# EAGLE design clock_motherboard (EAGLE 7.4.0)
DATABASE: ../../PartsDatabase.txt
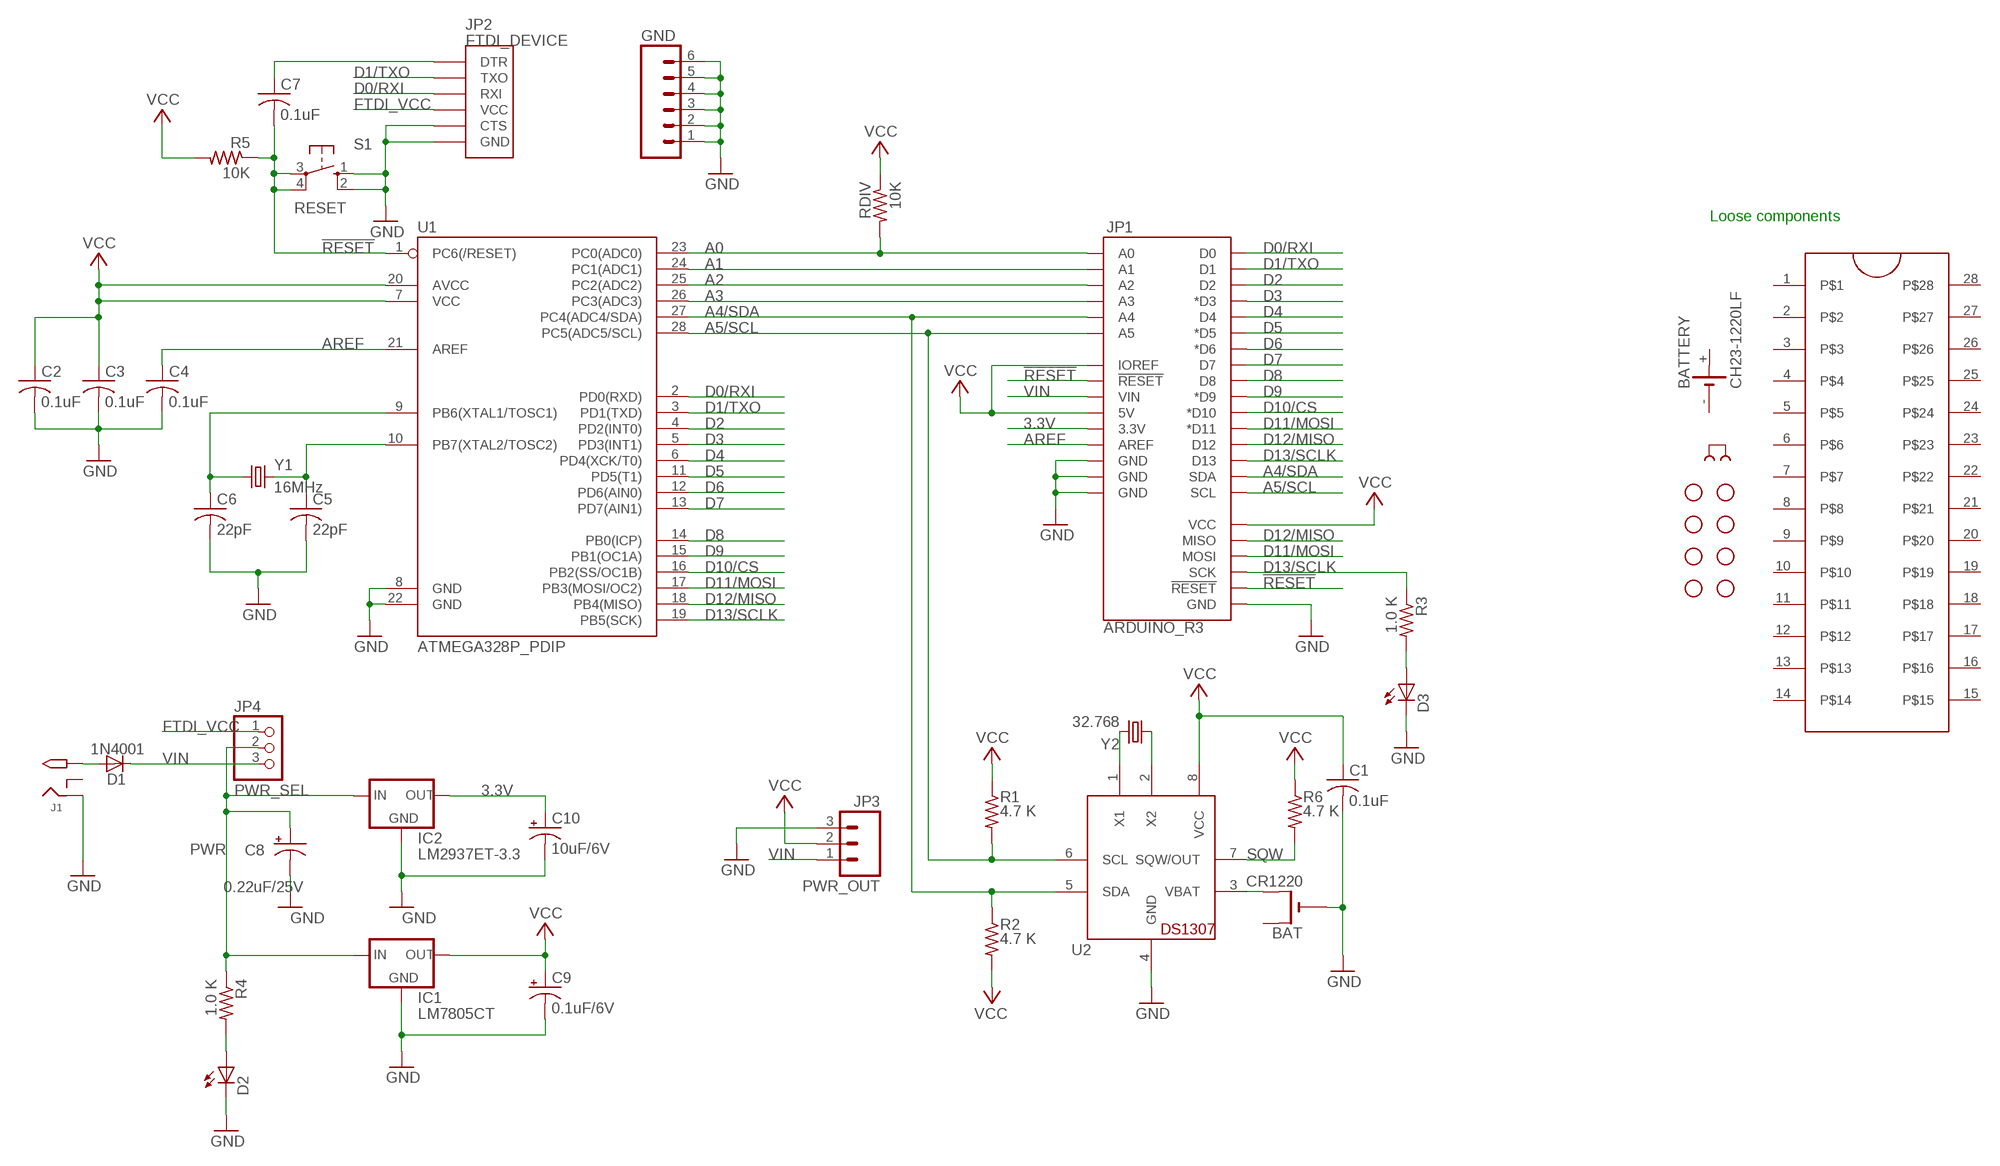
[diagram p0: schematic, sheet 1]

## Parts
BAT  CR1220  CR1220THM  [CR1220-THM]
BATTERY  CH23-1220LF  [CH23-1220LF]
C1  0.1uF  C-US025-025X050  [C025-025X050]
C2  0.1uF  C-US025-025X050  [C025-025X050]
C3  0.1uF  C-US025-025X050  [C025-025X050]
C4  0.1uF  C-US025-025X050  [C025-025X050]
C5  22pF  C-US025-025X050  [C025-025X050]
C6  22pF  C-US025-025X050  [C025-025X050]
C7  0.1uF  C-US025-025X050  [C025-025X050]
C8  0.22uF/25V  CPOL-USE2.5-6  [E2,5-6]
C9  0.1uF/6V  CPOL-USE2.5-6  [E2,5-6]
C10  10uF/6V  CPOL-USE2.5-6  [E2,5-6]
D1  1N4001  1N4004  [DO41-10]
D2  RED  LED3MM  [LED3MM]
D3  YELLOW  LED3MM  [LED3MM]
GND  M06NO_SILK_FEMALE_PTH  [1X06_NO_SILK]
IC1  LM7805CT  78XXS  [78XXS]
IC2  LM2937ET-3.3  78XXS  [78XXS]
J1  2.1MMJACK  [PJ-102A]
J2  PWR_SEL  JUMPER  [JUMP]
JP1  ARDUINO_R3  [ARDUINO_R3]
JP2  FTDI_DEVICE  [FTDI_DEVICE_SIDE]
JP3  PWR_OUT  M03SCREW  [SCREWTERMINAL-3.5MM-3]
JP4  PWR_SEL  PINHD-1X3  [1X03]
R1  4.7 K  R-US_0207/5V  [0207/5V]
R2  4.7 K  R-US_0207/5V  [0207/5V]
R3  1.0 K  R-US_0207/5V  [0207/5V]
R4  1.0 K  R-US_0207/5V  [0207/5V]
R5  10K  R-US_0207/5V  [0207/5V]
R6  4.7 K  R-US_0207/5V  [0207/5V]
RDIV  10K  R-US_0207/5V  [0207/5V]
S1  RESET  10-XX  [B3F-10XX]
SOCKET  ZIFSOCKET-28-3ZIFFSOCKET-28-3  [DIL28-3-ZIF_SOCKET]
STANDOFF1  STAND-OFF  [STAND-OFF]
STANDOFF2  STAND-OFF  [STAND-OFF]
STANDOFF3  STAND-OFF  [STAND-OFF]
STANDOFF4  STAND-OFF  [STAND-OFF]
STANDOFF5  STAND-OFF  [STAND-OFF]
STANDOFF6  STAND-OFF  [STAND-OFF]
STANDOFF7  STAND-OFF  [STAND-OFF]
STANDOFF8  STAND-OFF  [STAND-OFF]
U1  ATMEGA328P_PDIP  [DIL28-3]
U2  DS1307  [DIL08]
Y1  16MHz  CRYSTALHC49US  [HC49US]
Y2  32.768  CRYTALTC38H  [TC38H]

## Nets
3.3V: C10.+ IC2.OUT JP1.3.3V
!RESET: C7.2 JP1.RESET@1(!RESET!) JP1.RESET@2(!RESET!) R5.1 S1.3(P) S1.4(P1) U1.1(PC6(/RESET))
A0: JP1.A0 RDIV.2 U1.23(PC0(ADC0))
A1: JP1.A1 U1.24(PC1(ADC1))
A2: JP1.A2 U1.25(PC2(ADC2))
A3: JP1.A3 U1.26(PC3(ADC3))
A4/SDA: JP1.A4 JP1.SDA R2.1 U1.27(PC4(ADC4/SDA)) U2.5(SDA)
A5/SCL: JP1.A5 JP1.SCL R1.2 U1.28(PC5(ADC5/SCL)) U2.6(SCL)
AREF: C4.1 JP1.AREF U1.21(AREF)
D0/RXI: JP1.D0 JP2.P$3(RXI) U1.2(PD0(RXD))
D1/TXO: JP1.D1 JP2.P$2(TXO) U1.3(PD1(TXD))
D2: JP1.D2 U1.4(PD2(INT0))
D3: JP1.D3(*D3) U1.5(PD3(INT1))
D4: JP1.D4 U1.6(PD4(XCK/T0))
D5: JP1.D5(*D5) U1.11(PD5(T1))
D6: JP1.D6(*D6) U1.12(PD6(AIN0))
D7: JP1.D7 U1.13(PD7(AIN1))
D8: JP1.D8 U1.14(PB0(ICP))
D9: JP1.D9(*D9) U1.15(PB1(OC1A))
D10/CS: JP1.D10(*D10) U1.16(PB2(SS/OC1B))
D11/MOSI: JP1.D11(*D11) JP1.MOSI U1.17(PB3(MOSI/OC2))
D12/MISO: JP1.D12 JP1.MISO U1.18(PB4(MISO))
D13/SCLK: JP1.D13 JP1.SCK R3.1 U1.19(PB5(SCK))
FTDI_VCC: JP2.P$4(VCC) JP4.1
GND: BAT.- C1.2 C2.2 C3.2 C4.2 C5.2 C6.2 C8.- C9.- C10.- D2.K(C) D3.K(C) GND.1 GND.2 GND.3 GND.4 GND.5 GND.6 IC1.GND IC2.GND J1.RING JP1.GND@1(GND) JP1.GND@2(GND) JP1.GND@3(GND) JP1.GND@4(GND) JP2.P$5(CTS) JP2.P$6(GND) JP3.3 S1.1(S) S1.2(S1) U1.8(GND) U1.22(GND) U2.4(GND)
N$1: C6.1 U1.9(PB6(XTAL1/TOSC1)) Y1.1
N$2: C5.1 U1.10(PB7(XTAL2/TOSC2)) Y1.2
N$3: C7.1 JP2.P$1(DTR)
N$4: D3.A R3.2
N$5: D2.A R4.2
N$14: U2.1(X1) Y2.2
N$15: U2.2(X2) Y2.1
N$17: D1.A J1.TIP
N$39: BAT.+2(+1) U2.3(VBAT)
PWR: C8.+ IC1.IN IC2.IN JP4.2 R4.1
SQW: R6.2 U2.7(SQW/OUT)
VCC: C1.1 C2.1 C3.1 C9.+ IC1.OUT JP1.5V JP1.IOREF JP1.VCC JP3.2 R1.1 R2.2 R5.2 R6.1 RDIV.1 U1.7(VCC) U1.20(AVCC) U2.8(VCC)
VIN: D1.C JP1.VIN JP3.1 JP4.3
Unconnected: BAT.+1(+) BATTERY.+ BATTERY.- J1.RING_SW SOCKET.1 SOCKET.2 SOCKET.3 SOCKET.4 SOCKET.5 SOCKET.6 SOCKET.7 SOCKET.8 SOCKET.9 SOCKET.10 SOCKET.11 SOCKET.12 SOCKET.13 SOCKET.14 SOCKET.15 SOCKET.16 SOCKET.17 SOCKET.18 SOCKET.19 SOCKET.20 SOCKET.21 SOCKET.22 SOCKET.23 SOCKET.24 SOCKET.25 SOCKET.26 SOCKET.27 SOCKET.28

## Notes on the sheet
- Loose components

## Library data of the parts
BAT = adafruit:CR1220: CR1216/CR1220/CR1225 12mm 3V lithium coin cell Great for battery packup. Both SMT and THM holders. Note the THM package has the ground pads on both sides of the PCB so that the masks are the same - this reduces the cost; PARTNO: 3001
BATTERY = battery:CH23-1220LF: Battary Holder, DIP, 12mm multicomp PART NO. CH-1220LF Source: Data sheet <http://www.farnell.com/datasheets/1505861.pdf>; PARTNO: CR1220
C1-C4 C7 = adafruit:C-US: CAPACITOR, American symbol; PARTNO: 21RZ310-RC
C5 C6 = adafruit:C-US: CAPACITOR, American symbol; PARTNO: K220J15C0GF5TL2
C8 = minimidi:CPOL-US: POLARIZED CAPACITOR, American symbol; PARTNO: FG14X7R1H224KNT06
C9 = minimidi:CPOL-US: POLARIZED CAPACITOR, American symbol; PARTNO: 21RZ310-RC
C10 = minimidi:CPOL-US: POLARIZED CAPACITOR, American symbol; PARTNO: A758BG106M1EAAE070
D1 = minimidi:1N4004: DIODE general purpose rectifier, 1 A; PARTNO: 1N4001-TP
D2 = minimidi:LED: LED OSRAM: - CHIPLED LG R971, LG N971, LY N971, LG Q971, LY Q971, LO R971, LY R971 LH N974, LH R974 LS Q976, LO Q976, LY Q976 LO Q996 - Hyper CHIPLED LW Q18S LB Q993, LB Q99A, LB R99A - SideLED LS A670, LO A670, LY A670, LG A670, LP A670 LB A673, LV A673, LT A673, LW A673 LH A674 LY A675 LS A676, LA A676, LO A676, LY A676, LW A676 LS A679, LY A679, LG A679 - Hyper Micro SIDELED® LS Y876, LA Y876, LO Y876, LY Y876 LT Y87S - SmartLED LW L88C, LW L88S LB L89C, LB L89S, LG L890 LS L89K, LO L89K, LY L89K LS L896, LA L896, LO L896, LY L896 - TOPLED LS T670, LO T670, LY T670, LG T670, LP T670 LSG T670, LSP T670, LSY T670, LOP T670, LYG T670 LG T671, LOG T671, LSG T671 LB T673, LV T673, LT T673, LW T673 LH T674 LS T676, LA T676, LO T676, LY T676, LB T676, LH T676, LSB T676, LW T676 LB T67C, LV T67C, LT T67C, LS T67K, LO T67K, LY T67K, LW E67C LS E67B, LA E67B, LO E67B, LY E67B, LB E67C, LV E67C, LT E67C LW T67C LS T679, LY T679, LG T679 LS T770, LO T770, LY T770, LG T770, LP T770 LB T773, LV T773, LT T773, LW T773 LH T774 LS E675, LA E675, LY E675, LS T675 LS T776, LA T776, LO T776, LY T776, LB T776 LHGB T686 LT T68C, LB T68C - Hyper Mini TOPLED® LB M676 - Mini TOPLED Santana® LG M470 LS M47K, LO M47K, LY M47K Source: http://www.osram.convergy.de/; PARTNO: WP7113SRD/D
D3 = minimidi:LED: LED OSRAM: - CHIPLED LG R971, LG N971, LY N971, LG Q971, LY Q971, LO R971, LY R971 LH N974, LH R974 LS Q976, LO Q976, LY Q976 LO Q996 - Hyper CHIPLED LW Q18S LB Q993, LB Q99A, LB R99A - SideLED LS A670, LO A670, LY A670, LG A670, LP A670 LB A673, LV A673, LT A673, LW A673 LH A674 LY A675 LS A676, LA A676, LO A676, LY A676, LW A676 LS A679, LY A679, LG A679 - Hyper Micro SIDELED® LS Y876, LA Y876, LO Y876, LY Y876 LT Y87S - SmartLED LW L88C, LW L88S LB L89C, LB L89S, LG L890 LS L89K, LO L89K, LY L89K LS L896, LA L896, LO L896, LY L896 - TOPLED LS T670, LO T670, LY T670, LG T670, LP T670 LSG T670, LSP T670, LSY T670, LOP T670, LYG T670 LG T671, LOG T671, LSG T671 LB T673, LV T673, LT T673, LW T673 LH T674 LS T676, LA T676, LO T676, LY T676, LB T676, LH T676, LSB T676, LW T676 LB T67C, LV T67C, LT T67C, LS T67K, LO T67K, LY T67K, LW E67C LS E67B, LA E67B, LO E67B, LY E67B, LB E67C, LV E67C, LT E67C LW T67C LS T679, LY T679, LG T679 LS T770, LO T770, LY T770, LG T770, LP T770 LB T773, LV T773, LT T773, LW T773 LH T774 LS E675, LA E675, LY E675, LS T675 LS T776, LA T776, LO T776, LY T776, LB T776 LHGB T686 LT T68C, LB T68C - Hyper Mini TOPLED® LB M676 - Mini TOPLED Santana® LG M470 LS M47K, LO M47K, LY M47K Source: http://www.osram.convergy.de/; PARTNO: WP7113SYD
GND = SparkFun-Connectors:M06: Header 6 Standard 6-pin 0.1" header. Use with straight break away headers (SKU : PRT-00116), right angle break away headers (PRT-00553), swiss pins (PRT-00743), machine pins (PRT-00117), and female headers (PRT-00115). Molex polarized connector foot print use with SKU : PRT-08094 with associated crimp pins and housings. NOTES ON THE VARIANTS LOCK and LOCK_LONGPADS... This footprint was designed to help hold the alignment of a through-hole component (i.e. 6-pin header) while soldering it into place. You may notice that each hole has been shifted either up or down by 0.005 of an inch from it's more standard position (which is a perfectly straight line). This slight alteration caused the pins (the squares in the middle) to touch the edges of the holes. Because they are alternating, it causes a "brace" to hold the component in place. 0.005 has proven to be the perfect amount of "off-center" position when using our standard breakaway headers. Although looks a little odd when you look at the bare footprint, once you have a header in there, the alteration is very hard to notice. Also,if you push a header all the way into place, it is covered up entirely on the bottom side. This idea of altering the position of holes to aid alignment will be further integrated into the Sparkfun Library for other footprints. It can help hold any component with 3 or more connection pins.; BOM: EXCLUDE; PROD_ID: CONN-08437
IC1 = v-reg:78XXS: VOLTAGE REGULATOR; PARTNO: LM7805CT/NOPB
IC2 = v-reg:78XXS: VOLTAGE REGULATOR; PARTNO: LM2937ET-3.3/NOPB
J1 = minimidi:2.1MMJACK; PARTNO: PJ-102AH
J2 = jumper:JUMPER: JUMPER header; PARTNO: 382811-8
JP1 = clock_motherboard:ARDUINO_R3: Arduino R3 Footprint (w/ SPI header); BOM: EXCLUDE
JP2 = clock_motherboard:FTDI_DEVICE: Connector which mates to FTDI basic or FTDI cable.; PARTNO: 68000-406HLF
JP3 = SparkFun-Connectors:M03: Header 3 Standard 3-pin 0.1" header. Use with straight break away headers (SKU : PRT-00116), right angle break away headers (PRT-00553), swiss pins (PRT-00743), machine pins (PRT-00117), and female headers (PRT-00115). Molex polarized connector foot print use with SKU : PRT-08232 with associated crimp pins and housings.; PARTNO: 1546551-3; PROD_ID: CONN-08288
JP4 = pinhead:PINHD-1X3: PIN HEADER; PARTNO: 68001-403HLF
R1 R2 R6 = minimidi:R-US_: RESISTOR, American symbol; PARTNO: CFR-25JB-52-4K7
R3 R4 = minimidi:R-US_: RESISTOR, American symbol; PARTNO: CFR-25JB-52-1K
R5 RDIV = rcl-ez:R-US_: RESISTOR, American symbol; PARTNO: CFR-25JB-52-10K
S1 = switch-omron:10-XX: OMRON SWITCH; MPN: B3F-1000; OC_FARNELL: 176432; OC_NEWARK: 36M3542
SOCKET = SparkFun-Connectors:ZIFSOCKET-28-3: Lever-action ZIF socket for 28-pin ICs; PARTNO: 4828-3004-CP
STANDOFF1-STANDOFF4 = SparkFun-Electromechanical:STAND-OFF: #4 Stand Off This is the mechanical footprint for a #4 phillips button head screw. Use the keepout ring to avoid running the screw head into surrounding components. SKU : PRT-00447; PARTNO: 2200
STANDOFF5-STANDOFF8 = SparkFun-Electromechanical:STAND-OFF: #4 Stand Off This is the mechanical footprint for a #4 phillips button head screw. Use the keepout ring to avoid running the screw head into surrounding components. SKU : PRT-00447; PARTNO: 9900
U1 = SparkFun-DigitalIC:ATMEGA328P_PDIP: uC used in the Arduino 32kb flash, 1k EEPROM, 2k SRAM This is the through-hole version of this chip.; PARTNO: ATMEGA328P-PU
U2 = adafruit:DS1307: DS1307 Real time clock (RTC) with battery backup ability. Talk to it via i2c; PARTNO: DS1307+
Y1 = SparkFun-FreqCtrl:CRYSTAL: Various standard crystals. Proven footprints.; PARTNO: HC49US-16.000MABJ-UB
Y2 = crystal:CRYTAL: CRYSTAL; PARTNO: AB38T-32.768KHZ

## Net classes
1 power: width 0.61 mm, drill 0.61 mm, clearance 0.254 mm
2 gnd: width 0.305 mm, drill 0.559 mm, clearance 0.254 mm

## Board
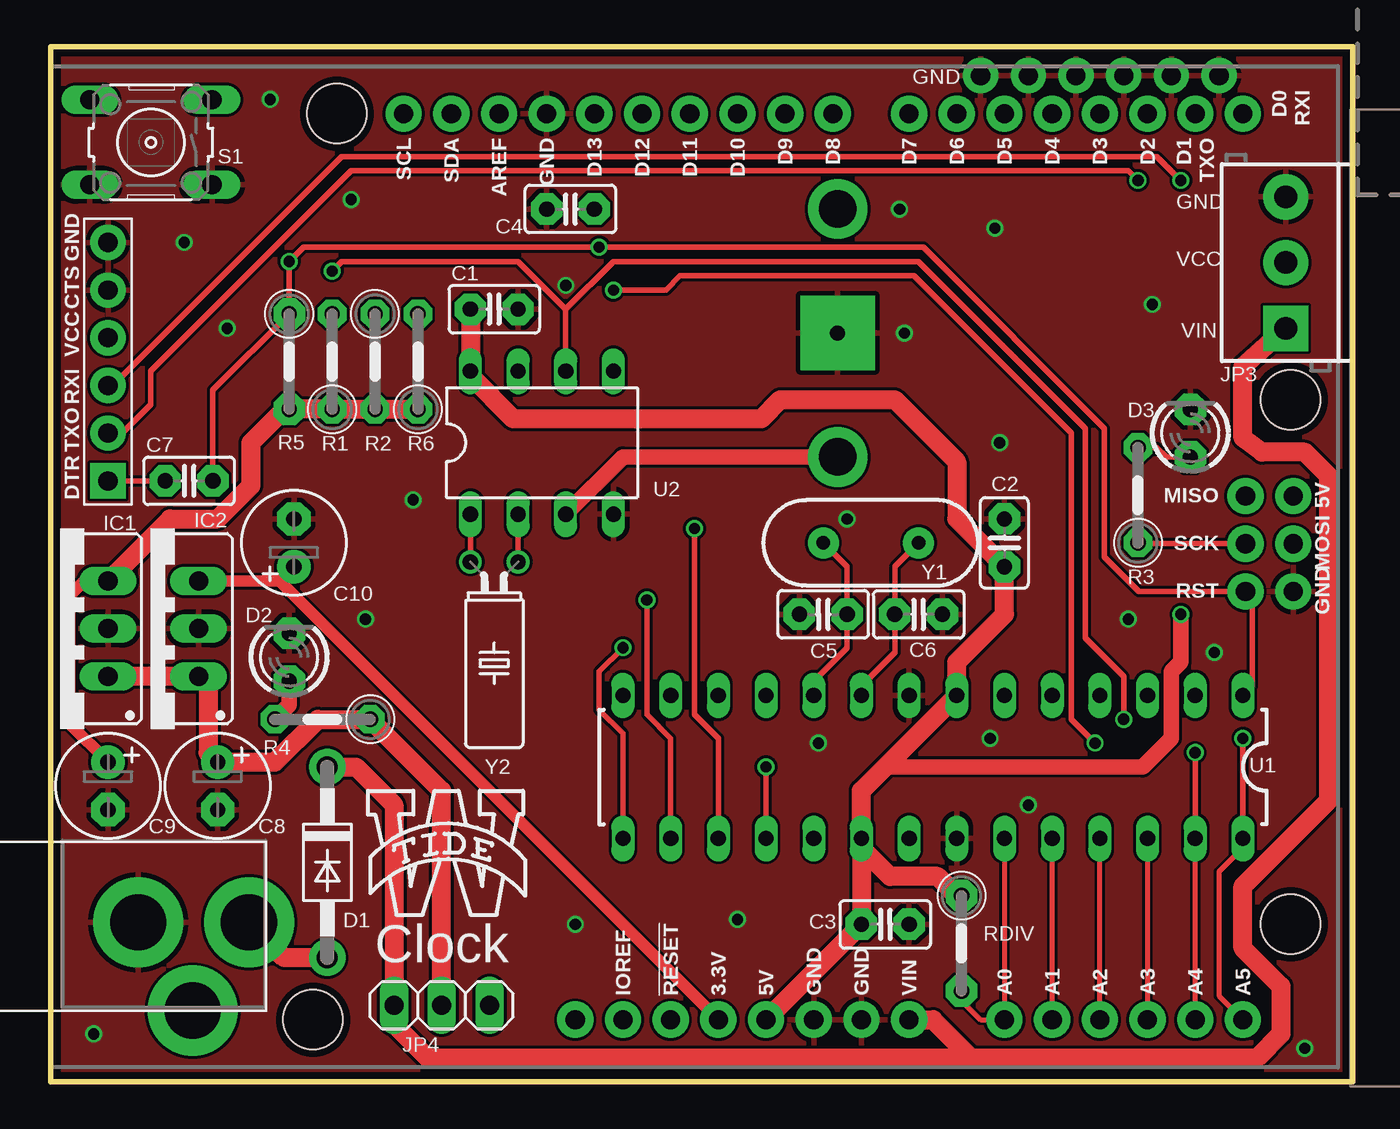
[diagram p1: board, top side]
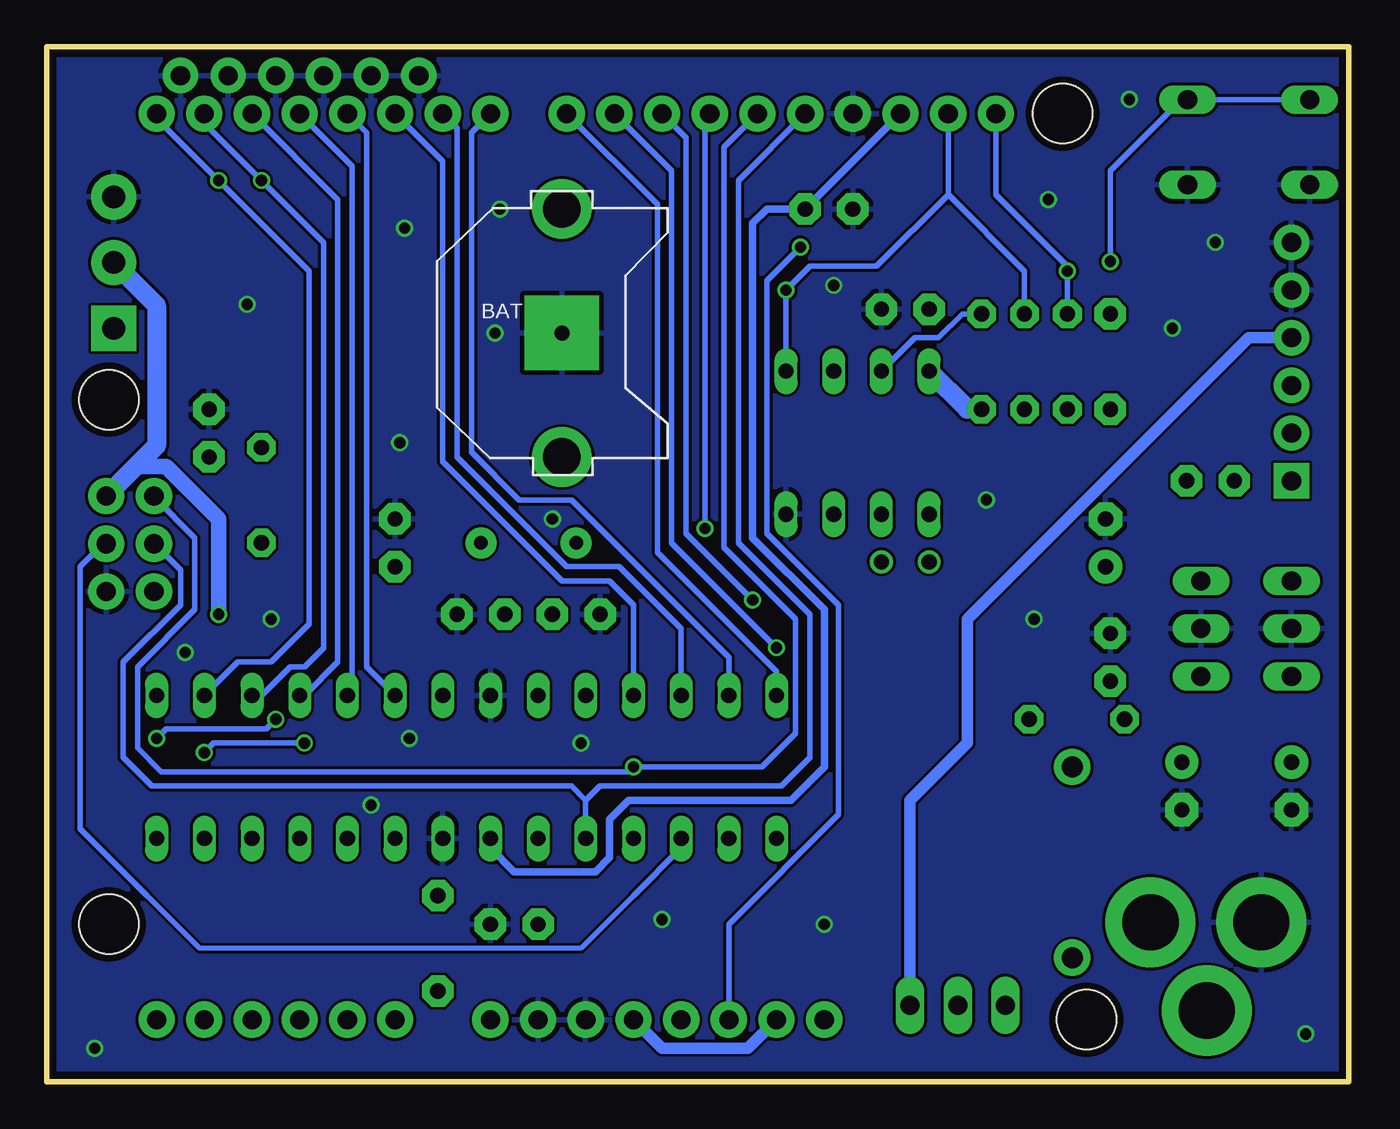
[diagram p2: board, bottom side, seen from below]

Size 69.34 x 55.12 mm. Coordinates in mm from the lower left corner, seen from the top.
Outline: 0,0 69.34,0 69.34,55.12 0,55.12 0,0
Copper layers (1*16): Top 0.035559375mm / dielectric 1.6mm / Bottom 0.035559375mm
Design rules "oshpark-2layer": minimum track width 6mil, minimum drill 10mil, track to track 6mil, track to pad 6mil, pad to pad 6mil, via to via 6mil, smd to smd 6mil, copper to edge 15mil, drill to drill 6mil, minimum pad ring 5mil, minimum via ring 5mil, stop-mask expansion 2.5mil, vias tented up to drill 0mil, thermal gap 10mil

### Footprints (pad centres in the part's own frame; a part is rotated, then mirrored left to right if it is on the bottom)
CR1220-THM = drill 2 pad 3.175: +1 -6.604,0; +2 6.604,0 | drill 0.8 pad 3.962 square: - 0,0
CH23-1220LF = drill 1 pad 1.6: + -6.425,-3.862; - 0,0
C025-025X050 = drill 0.813 pad 1.676 octagon: 1 -1.27,0; 2 1.27,0
E2,5-6 = drill 0.813 pad 1.778: + -1.27,0 | drill 0.813 pad 1.778 octagon: - 1.27,0
DO41-10 = drill 1.118 pad 1.93: A 5.08,0; C -5.08,0
LED3MM = drill 0.813 pad 1.676 octagon: A -1.27,0; K 1.27,0
1X06_NO_SILK = drill 1.016 pad 1.88: 1 0,0; 2 2.54,0; 3 5.08,0; 4 7.62,0; 5 10.16,0; 6 12.7,0
78XXS = drill 1.016 long: GND 0,-2.54; IN -2.54,-2.54; OUT 2.54,-2.54
PJ-102A = drill 3 pad 4.8: RING 0.1,-3.39; RING_SW -4.6,-6.29; TIP 0.1,-9.29
ARDUINO_R3 = drill 1.016 pad 1.93: 3.3V 35.56,2.54; 5V 38.1,2.54; A0 50.8,2.54; A1 53.34,2.54; A2 55.88,2.54; A3 58.42,2.54; A4 60.96,2.54; A5 63.5,2.54; AREF 23.876,50.8; D0 63.5,50.8; D1 60.96,50.8; D2 58.42,50.8; D3 55.88,50.8; D4 53.34,50.8; D5 50.8,50.8; D6 48.26,50.8; D7 45.72,50.8; D8 41.656,50.8; D9 39.116,50.8; D10 36.576,50.8; D11 34.036,50.8; D12 31.496,50.8; D13 28.956,50.8; GND@1 40.64,2.54; GND@2 43.18,2.54; GND@3 26.416,50.8; GND@4 66.18,25.35; IOREF 30.48,2.54; MISO 63.64,30.43; MOSI 66.18,27.89; NC 27.94,2.54; RESET@1 33.02,2.54; RESET@2 63.64,25.35; SCK 63.64,27.89; SCL 18.796,50.8; SDA 21.336,50.8; VCC 66.18,30.43; VIN 45.72,2.54 | hole 3.175: 15.24,50.8; 66.04,35.56; 66.04,7.62; 13.97,2.54
FTDI_DEVICE_SIDE = drill 1.016 pad 1.88 square: P$1 -6.35,0 | drill 1.016 pad 1.88: P$2 -3.81,0; P$3 -1.27,0; P$4 1.27,0; P$5 3.81,0; P$6 6.35,0
SCREWTERMINAL-3.5MM-3 = drill 1.2 pad 2.413 square: 1 0,0 | drill 1.2 pad 2.413: 2 3.5,0; 3 7,0
1X03 = drill 1.016 long: 1 -2.54,0; 2 0,0; 3 2.54,0
0207/5V = drill 0.813 pad 1.524 octagon: 1 -2.54,0; 2 2.54,0
0207/5V' = drill 0.813 pad 1.676 octagon: 1 -2.54,0; 2 2.54,0
B3F-10XX = drill 1.016 long: 1 -3.251,2.261; 2 3.251,2.261; 3 -3.251,-2.261; 4 3.251,-2.261
DIL28-3-ZIF_SOCKET = drill 1.016 pad 1.88: 1 -16.51,-3.81; 2 -13.97,-3.81; 3 -11.43,-3.81; 4 -8.89,-3.81; 5 -6.35,-3.81; 6 -3.81,-3.81; 7 -1.27,-3.81; 8 1.27,-3.81; 9 3.81,-3.81; 10 6.35,-3.81; 11 8.89,-3.81; 12 11.43,-3.81; 13 13.97,-3.81; 14 16.51,-3.81; 15 16.51,3.81; 16 13.97,3.81; 17 11.43,3.81; 18 8.89,3.81; 19 6.35,3.81; 20 3.81,3.81; 21 1.27,3.81; 22 -1.27,3.81; 23 -3.81,3.81; 24 -6.35,3.81; 25 -8.89,3.81; 26 -11.43,3.81; 27 -13.97,3.81; 28 -16.51,3.81
STAND-OFF = hole 3.302: 0,0
DIL28-3 = drill 0.813 long: 1 -16.51,-3.81; 2 -13.97,-3.81; 3 -11.43,-3.81; 4 -8.89,-3.81; 5 -6.35,-3.81; 6 -3.81,-3.81; 7 -1.27,-3.81; 8 1.27,-3.81; 9 3.81,-3.81; 10 6.35,-3.81; 11 8.89,-3.81; 12 11.43,-3.81; 13 13.97,-3.81; 14 16.51,-3.81; 15 16.51,3.81; 16 13.97,3.81; 17 11.43,3.81; 18 8.89,3.81; 19 6.35,3.81; 20 3.81,3.81; 21 1.27,3.81; 22 -1.27,3.81; 23 -3.81,3.81; 24 -6.35,3.81; 25 -8.89,3.81; 26 -11.43,3.81; 27 -13.97,3.81; 28 -16.51,3.81
DIL08 = drill 0.813 long: 1 -3.81,-3.81; 2 -1.27,-3.81; 3 1.27,-3.81; 4 3.81,-3.81; 5 3.81,3.81; 6 1.27,3.81; 7 -1.27,3.81; 8 -3.81,3.81
HC49US = drill 0.7 pad 1.651: 1 -2.54,0; 2 2.54,0
TC38H = drill 0.813: 1 -1.27,0; 2 1.27,0

### Placement (x,y rotation side)
BAT  41.91,39.88 270 bottom
BATTERY  91.44,7.11 0 top  (outside the outline)
C1  23.62,41.15 0 top
C2  50.8,28.7 90 top
C3  44.45,8.38 0 top
C4  27.69,46.48 180 top
C5  41.15,24.89 180 top
C6  46.23,24.89 0 top
C7  7.37,32 0 top
C8  8.89,15.75 270 top
C9  3.05,15.75 270 top
C10  12.95,28.7 90 top
D1  14.73,11.68 270 top
D2  12.7,22.61 90 top
D3  60.71,34.54 90 top
GND  49.53,53.59 0 top
IC1  0.51,24.13 90 top
IC2  5.33,24.13 90 top
J1  1.27,8.38 90 top
J2  74.93,3.05 0 top  (outside the outline)
JP1  0,0.76 0 top
JP2  3.05,38.35 90 top
JP3  65.79,40.13 90 top
JP4  20.83,4.06 180 top
R1  14.99,38.35 90 top
R2  17.27,38.35 270 top
R3  57.91,31.24 90 top
R4  14.48,19.3 180 top
R5  10K  [0207/5V']  12.7,38.35 270 top
R6  19.56,38.35 90 top
RDIV  10K  [0207/5V']  48.51,7.37 270 top
S1  5.33,50.04 180 top
SOCKET  77.22,25.65 270 top  (outside the outline)
STANDOFF1  87.63,21.59 0 top  (outside the outline)
STANDOFF2  87.63,39.12 0 top  (outside the outline)
STANDOFF3  87.63,33.27 0 top  (outside the outline)
STANDOFF4  87.63,27.43 0 top  (outside the outline)
STANDOFF5  93.73,39.12 0 top  (outside the outline)
STANDOFF6  93.73,21.59 0 top  (outside the outline)
STANDOFF7  93.73,33.27 0 top  (outside the outline)
STANDOFF8  93.73,27.43 0 top  (outside the outline)
U1  46.99,16.76 180 top
U2  26.16,34.04 0 top
Y1  43.69,28.7 180 top
Y2  23.62,27.69 180 top

### Tracks (layer width: path | path; a pad name or v marks a point on that pad's centre or on a via)
3.3V
  Top 0.61: IC2.OUT 12.19,26.67 | 12.19,26.67 C10.+ | 12.19,26.67 31.11,7.75 31.5,7.37 JP1.3.3V
!RESET  (via drill 0.6)
  Top 0.305: 63.59,26.16 JP1.RESET@2 | JP1.RESET@2 63.64,26.02 64.01,25.65 64.01,21.08 U1.1 | JP1.RESET@2 57.96,26.11 56.13,27.94 56.13,34.8 46.48,44.45 v29.21,44.45 13.46,44.45 v12.7,43.69 R5.1 8.64,36.83 C7.2
  Bottom 0.305: S1.4 S1.3 8.91,52.3 12.7,48.51 v12.7,43.69 | JP1.RESET@1 33.02,8.38 27.18,14.22 27.18,25.4 30.99,29.21 30.99,42.67 v29.21,44.45
A0
  Top 0.254: U1.23 JP1.A0 49.53,3.3 48.51,4.32 RDIV.2
A1
  Top 0.254: JP1.A1 U1.24
A2
  Top 0.254: JP1.A2 U1.25
A3
  Top 0.254: U1.26 JP1.A3
A4/SDA  (via drill 0.6)
  Top 0.254: JP1.A4 60.96,12.45 U1.27
  Top 0.305: v55.63,18.03 54.36,19.3 54.36,34.54 45.97,42.93 33.53,42.93 32.77,42.16 v29.97,42.16 | v60.96,17.53 60.96,12.45
  Bottom 0.305: JP1.SDA 21.34,47.24 | 21.34,47.24 17.27,43.18 R2.1 17.53,40.89 | U2.5 v29.97,42.16 28.7,43.43 25.15,43.43 21.34,47.24 | v55.63,18.03 60.45,18.03 v60.96,17.53
A5/SCL  (via drill 0.6)
  Top 0.254: U1.28 63.5,12.45 62.23,11.18 62.23,4.57 JP1.A5
  Top 0.305: v57.15,19.3 57.15,21.59 55.12,23.62 55.12,34.8 46.23,43.69 29.97,43.69 27.43,41.15 | v63.5,18.29 U1.28 | U2.6 27.43,41.15 | 27.43,41.15 24.89,43.69 15.49,43.69 v14.99,43.18
  Bottom 0.305: 14.99,40.64 R1.2 v14.99,43.18 14.99,43.43 18.8,47.24 JP1.SCL | v57.15,19.3 57.66,18.8 62.99,18.8 v63.5,18.29
AREF
  Bottom 0.406: U1.21 45.72,12.45 44.45,11.18 40.13,11.18 39.37,11.94 39.37,13.97 38.35,14.99 29.72,14.99 27.94,16.76 27.94,25.15 31.75,28.96 31.75,45.72 30.99,46.48 C4.1 JP1.AREF
D0/RXI  (via drill 0.6)
  Top 0.305: JP2.P$3 3.3,37.08 15.49,49.28 58.93,49.28 v60.2,48.01
  Bottom 0.305: U1.2 59.18,22.35 57.4,22.35 55.37,24.38 55.37,43.18 v60.2,48.01 63.5,51.31 JP1.D0
D1/TXO  (via drill 0.6)
  Top 0.305: JP2.P$2 3.81,34.54 5.33,36.07 5.33,37.85 16,48.51 57.4,48.51 v57.91,48.01
  Bottom 0.305: U1.3 57.91,20.57 56.39,22.1 55.63,22.1 54.61,23.11 54.61,44.7 v57.91,48.01 60.96,51.05 JP1.D1
D2
  Bottom 0.305: U1.4 55.63,20.57 53.85,22.35 53.85,46.99 JP1.D2
D3
  Bottom 0.305: JP1.D3 53.09,48.77 53.09,20.83 U1.5
D4
  Bottom 0.305: JP1.D4 52.32,50.55 52.32,22.1 U1.6
D5
  Bottom 0.305: JP1.D5 48.26,49.02 48.26,33.02 41.91,26.67 39.37,26.67 38.1,25.4 U1.11
D6
  Bottom 0.305: U1.12 35.56,24.13 38.86,27.43 41.66,27.43 47.5,33.27 47.5,50.8 JP1.D6
D7
  Bottom 0.305: U1.13 33.02,22.61 41.4,30.99 44.2,30.99 46.74,33.53 46.74,50.55 JP1.D7
D8
  Bottom 0.305: U1.14 30.48,21.84 36.83,28.19 36.83,46.74 JP1.D8
D9  (via drill 0.6)
  Top 0.305: U1.15 30.48,18.54 29.21,19.81 29.21,21.84 v30.48,23.11
  Bottom 0.305: v30.48,23.11 36.07,28.7 36.07,48.51 JP1.D9
D10/CS  (via drill 0.6)
  Top 0.305: U1.16 33.02,18.29 31.75,19.56 v31.75,25.65
  Bottom 0.305: v31.75,25.65 35.31,29.21 35.31,50.29 JP1.D10
D11/MOSI  (via drill 0.6)
  Top 0.305: U1.17 35.56,18.29 34.29,19.56 v34.29,29.46
  Bottom 0.254: 38.1,9.91 40.89,7.11 61.21,7.11 64.01,9.91
  Bottom 0.305: JP1.MOSI 66.34,28.65 67.56,27.43 67.56,13.46 64.01,9.91 | U1.17 35.56,12.45 38.1,9.91 | v34.29,29.46 34.29,51.31 JP1.D11
D12/MISO  (via drill 0.6)
  Top 0.305: U1.18 v38.1,16.76
  Bottom 0.305: JP1.MISO 63.64,31.13 61.47,28.96 61.47,25.15 64.52,22.1 64.52,17.78 63.25,16.51 38.35,16.51 v38.1,16.76 31.24,16.76 29.46,18.54 29.46,24.64 33.27,28.45 33.27,49.78 JP1.D12
D13/SCLK
  Top 0.305: JP1.SCK 57.96,28.65 R3.1
  Bottom 0.305: U1.19 40.64,14.99 | 40.64,14.99 41.4,15.75 63.75,15.75 65.28,17.27 65.28,22.35 62.23,25.4 62.23,27.24 JP1.SCK | 40.64,14.99 39.88,15.75 30.23,15.75 28.7,17.27 28.7,24.89 32.51,28.7 32.51,48.01 JP1.D13
FTDI_VCC
  Bottom 0.61: JP4.1 23.37,14.99 20.32,18.03 20.32,24.64 5.33,39.62 JP2.P$4
GND  (via drill 0.6)
  other vias: 7.11,44.7 16,46.99 9.4,40.13 11.68,52.32 16.76,24.64 2.29,2.54 27.94,8.38 36.58,8.64 52.07,14.73 40.89,18.03 50.04,18.29 57.4,24.64 58.67,41.4 50.55,34.04 19.3,30.99 45.47,39.88 42.42,29.97 50.29,45.47 45.21,46.48 27.43,42.42 61.98,22.86 66.8,1.78
  pour Bottom: 0,55.12 69.34,55.12 69.34,0 0,0
  pour Top: 0,55.12 69.34,55.12 69.34,0 0,0
N$1
  Top 0.305: U1.9 43.18,21.08 44.96,22.86 C6.1 44.96,27.43 Y1.1
N$2
  Top 0.305: U1.10 40.64,21.34 42.42,23.11 C5.1 42.42,27.43 Y1.2
N$3
  Top 0.305: JP2.P$1 C7.1
N$4
  Top 0.305: R3.2 58.93,33.78 59.44,33.27 D3.A
N$5
  Top 0.813: D2.A 12.7,20.07 R4.2
N$14
  Top 0.305: U2.1 Y2.2
N$15
  Top 0.305: U2.2 Y2.1
N$17
  Top 1.016: D1.A 12.44,6.6 J1.TIP
N$39
  Top 0.813: U2.3 30.48,33.27 BAT.+2
PWR
  Top 1.016: JP4.2 20.83,15.49 R4.1 14.22,19.3 11.94,17.02 C8.+ 8.38,17.53 8.38,21.08 IC2.IN IC1.IN
SQW
  Bottom 0.305: R6.2 20.57,40.89 21.84,39.62 23.11,39.62 U2.7
VCC  (via drill 0.6)
  Top 0.61: IC1.OUT 1.78,26.67 1.02,25.91 1.02,19.05 C9.+
  Top 0.813: v60.2,24.89 60.2,22.35 59.69,21.84 59.69,18.29 58.17,16.76 44.45,16.76 | U2.8 22.35,37.59 | 12.45,35.81 R5.2
  Top 1.016: 43.18,12.45 U1.20 43.18,15.49 44.45,16.76 U1.7 48.26,22.35 50.8,24.89 C2.1 48.26,29.97 48.26,33.02 44.96,36.32 38.86,36.32 37.85,35.31 24.64,35.31 22.35,37.59 | 43.18,12.45 C3.1 JP1.5V | R6.1 R2.2 R1.1 R5.2 | C1.1 U2.8 | IC1.OUT 6.35,29.97 8.89,29.97 10.67,31.75 10.67,34.04 12.45,35.81 | RDIV.1 48.26,9.91 47.24,10.92 44.7,10.92 43.18,12.45
  Bottom 0.61: JP1.IOREF 32,1.78 36.58,1.78 JP1.5V
  Bottom 0.813: 64.61,32.77 62.99,32.77 60.2,29.97 v60.2,24.89
  Bottom 1.016: R6.1 20.32,35.81 U2.8 | JP1.VCC 64.61,32.77 63.5,33.87 63.5,41.35 JP3.2
VIN
  Top 1.016: D1.C 16.26,16.76 18.29,14.73 JP4.3 18.29,3.05 20.07,1.27 49.02,1.27 | 49.02,1.27 64.26,1.27 65.53,2.54 65.53,5.08 63.5,7.11 63.5,10.41 68.07,14.99 68.07,32.26 66.8,33.53 64.52,33.53 63.5,34.29 63.5,38.1 JP3.1 | JP1.VIN 46.99,3.3 49.02,1.27

### Text on the board
Dimension: Loose components
tPlace: Clock
tNames: GND | VCC | VIN